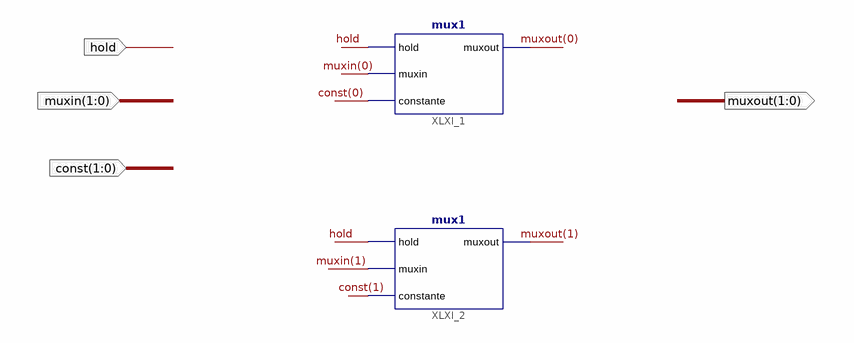
[diagram p0: schematic sheet 1]
// Xilinx ISE schematic mux2.sch (artix7) as structural Verilog: 2 symbols, 4 ports
module mux2 (
  input  hold,
  input  [1:0] muxin,
  input  [1:0] \const ,
  output [1:0] muxout
);

  mux1 XLXI_1 (.hold(hold), .muxin(muxin[0]), .constante(\const [0]), .muxout(muxout[0]));
  mux1 XLXI_2 (.hold(hold), .muxin(muxin[1]), .constante(\const [1]), .muxout(muxout[1]));
endmodule
